# EAGLE design skyperobot (EAGLE 6.5.0)

## Sheet 1 of 3
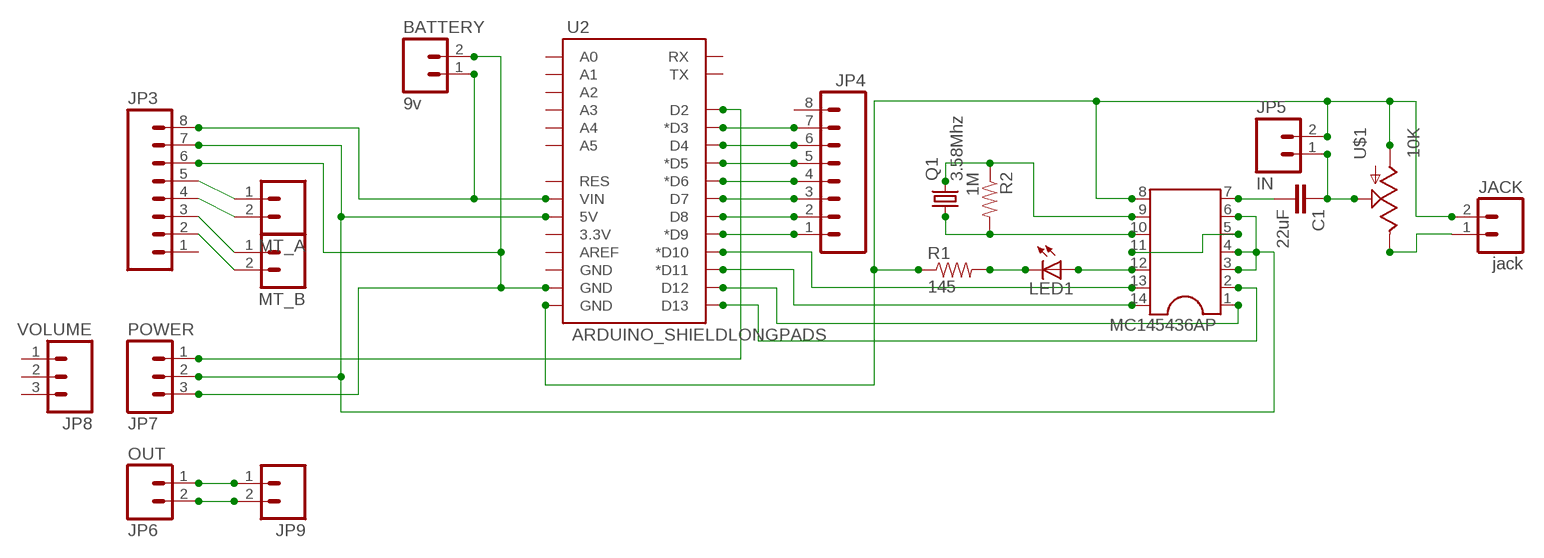
[diagram p0: schematic, sheet 1]

### Parts
BATTERY  9v  M02POLAR  [MOLEX-1X2]
C1  22uF  CAPPTH  [CAP-PTH-SMALL]
JACK  jack  M02LOCK_LONGPADS  [1X02_LOCK_LONGPADS]
JP3  M08LONGPADS  [1X08_LONGPADS]
JP4  M08LONGPADS  [1X08_LONGPADS]
JP5  IN  M02PTH  [1X02]
JP6  OUT  M02PTH  [1X02]
JP7  POWER  M03PTH  [1X03]
JP8  VOLUME  M03PTH  [1X03]
JP9  M02POLAR  [MOLEX-1X2]
LED1  LED3MM  [LED3MM]
MC145436AP  DIL14  [DIL14]
MT_A  M02POLAR  [MOLEX-1X2]
MT_B  M02POLAR  [MOLEX-1X2]
Q1  3.58Mhz  CRYSTALHC18U-H  [HC18U-H]
R1  145  RESISTORAXIAL-0.3  [AXIAL-0.3]
R2  1M  RESISTORAXIAL-0.3  [AXIAL-0.3]
U2  ARDUINO_SHIELDLONGPADS  [DUEMILANOVE_SHIELD_LONGPADS_NOHOLES]
U$1  10K  POTTRIM  [TRIM_POT_10MM]

### Nets
MT_A: JACK.2 JP5.2 MC145436AP.8 R1.P$1 U2.GND@0(GND) U$1.3(A)
N$1: MC145436AP.10 Q1.1 R2.P$2
N$2: MC145436AP.5 MC145436AP.11
N$3: JP3.7 JP7.2 MC145436AP.3 MC145436AP.4 MC145436AP.6 U2.5V
N$4 [power]: JP3.5 MT_A.1
N$5 [power]: JP3.4 MT_A.2
N$6 [power]: JP3.3 MT_B.1
N$7 [power]: JP3.2 MT_B.2
N$8: C1.2 MC145436AP.7
N$9: C1.1 JP5.1 U$1.1(S)
N$10: JP7.1 U2.D2
N$11 [power]: BATTERY.1 JP3.8 U2.VIN
N$12 [power]: BATTERY.2 JP3.6 JP7.3 U2.GND@1(GND)
N$15: LED1.K(C) R1.P$2
N$18: JP4.7 U2.D3(*D3)
N$19: JP4.6 U2.D4
N$20: JP4.5 U2.D5(*D5)
N$21: JP4.4 U2.D6(*D6)
N$22: JP4.3 U2.D7
N$23: JP4.2 U2.D8
N$24: JP4.1 U2.D9(*D9)
N$25: LED1.A MC145436AP.12
N$27: MC145436AP.1 U2.D12
N$30: JP6.1 JP9.1
N$31: JP6.2 JP9.2
N$34: MC145436AP.9 Q1.2 R2.P$1
N$39: MC145436AP.2 U2.D13
N$41: MC145436AP.14 U2.D11(*D11)
N$42: MC145436AP.13 U2.D10(*D10)
N$45: JACK.1 U$1.2(E)
Unconnected: JP3.1 JP4.8 JP8.1 JP8.2 JP8.3 U2.3.3V U2.A0 U2.A1 U2.A2 U2.A3 U2.A4 U2.A5 U2.AREF U2.GND@2(GND) U2.RES U2.RX U2.TX

## Sheet 2 of 3
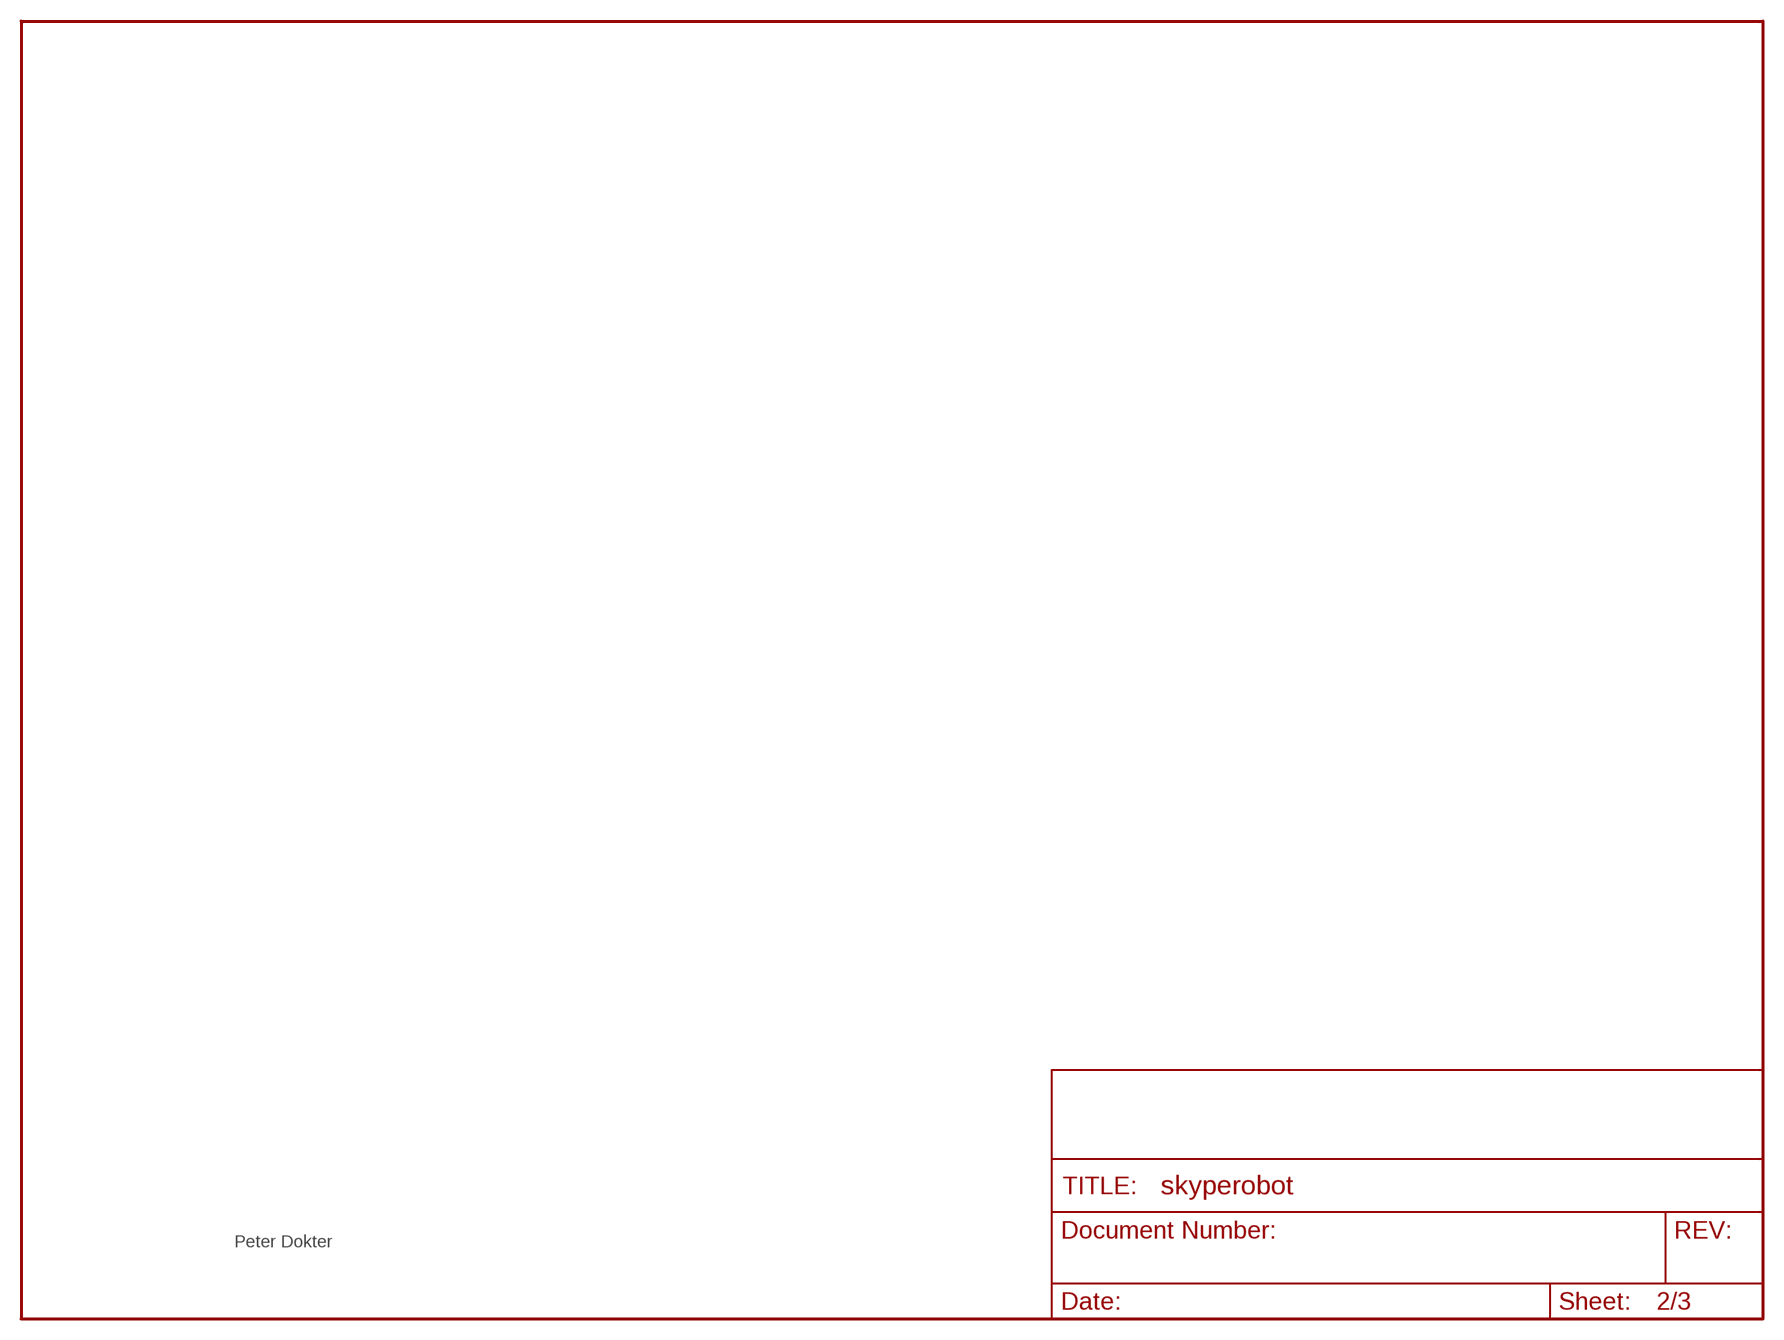
[diagram p1: schematic, sheet 2]

### Notes on the sheet
- Peter Dokter

## Sheet 3 of 3
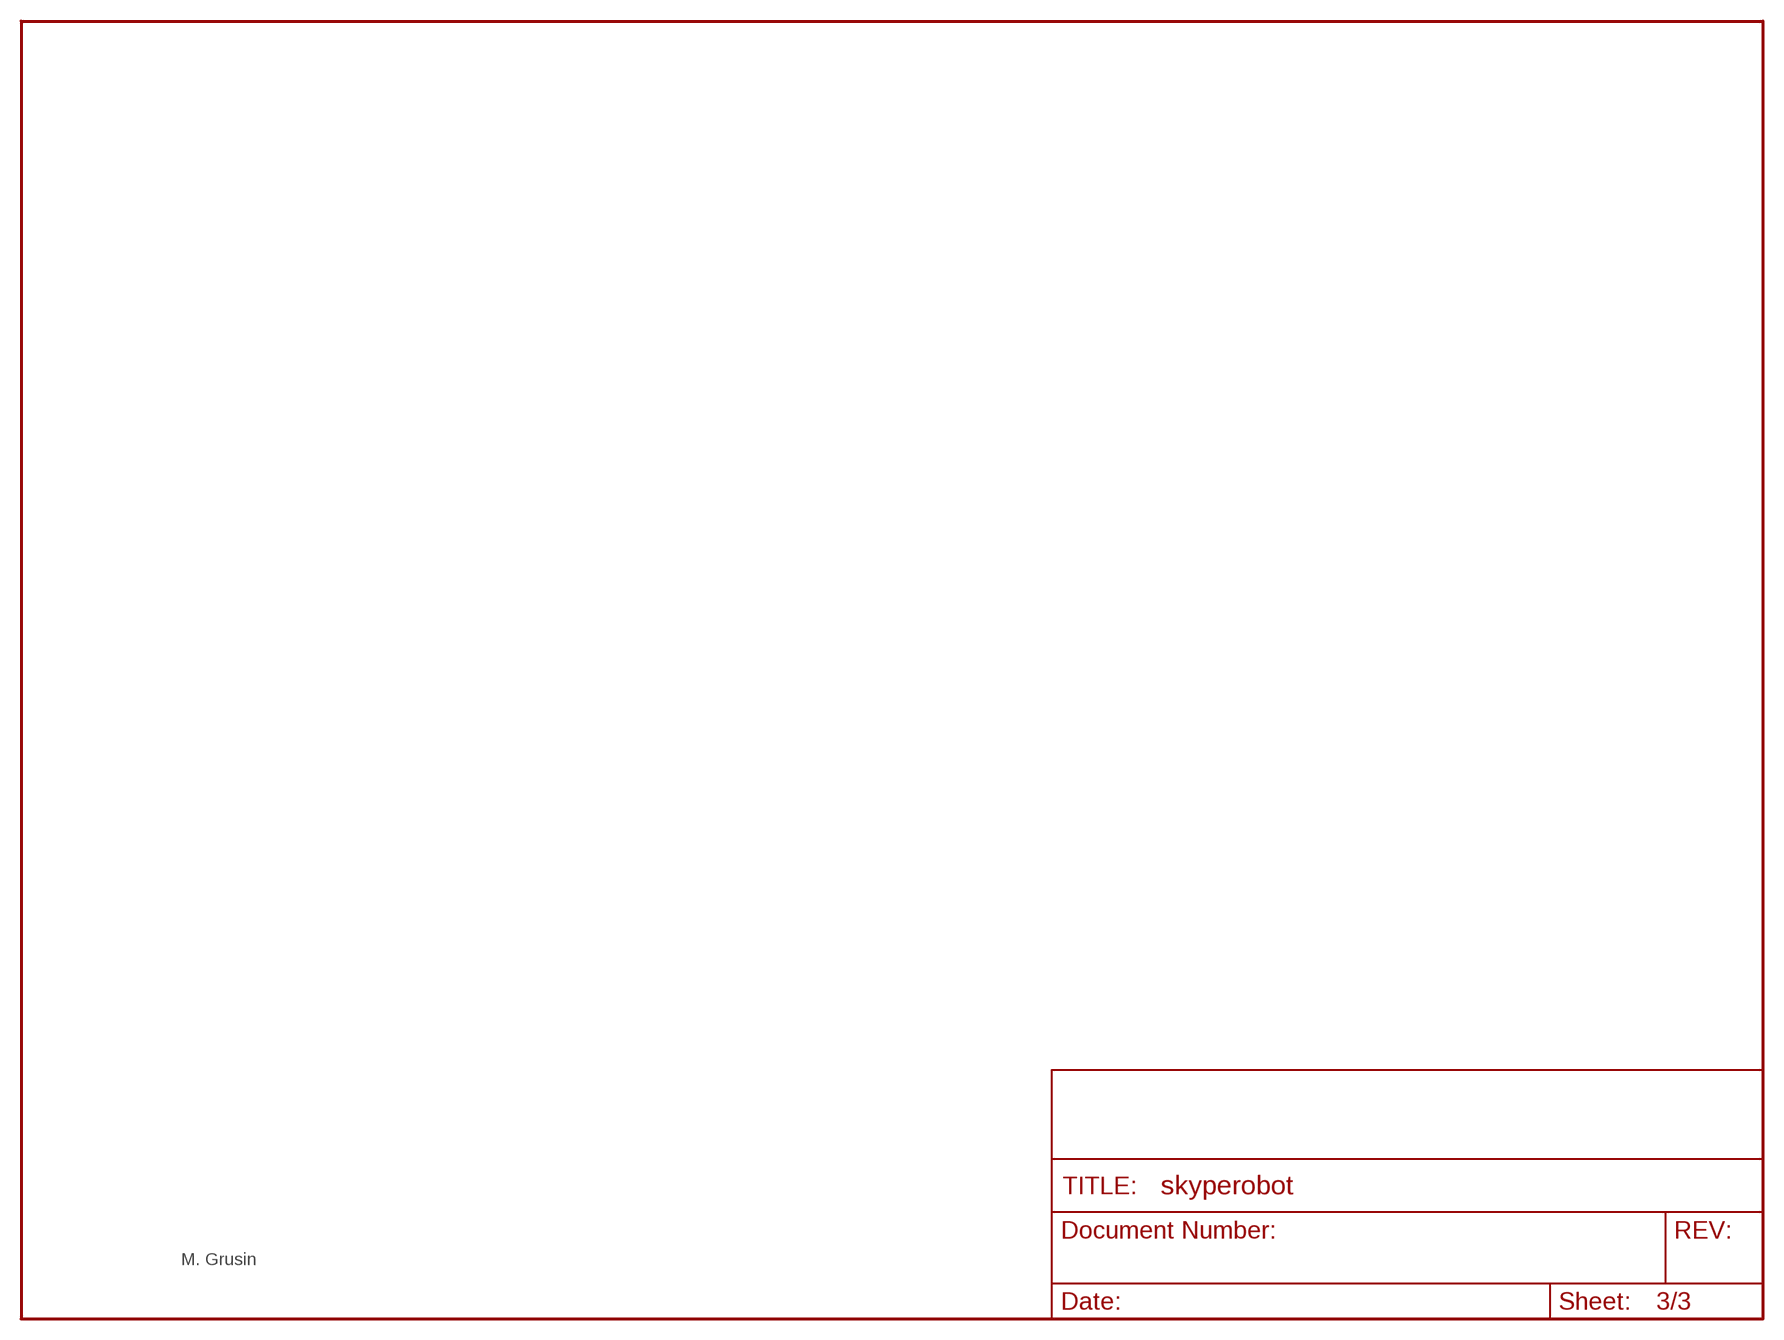
[diagram p2: schematic, sheet 3]

### Notes on the sheet
- M. Grusin

## Library data of the parts
BATTERY JACK JP5 JP6 JP9 MT_A MT_B = SparkFun:M02: Header 2 Standard 2-pin 0.1" header. Use with straight break away headers (SKU : PRT-00116), right angle break away headers (PRT-00553), swiss pins (PRT-00743), machine pins (PRT-00117), and female headers (PRT-00115). Molex polarized connector foot print use with SKU : PRT-08233 with associated crimp pins and housings.
C1 = SparkFun:CAP: Capacitor Standard 0603 ceramic capacitor, and 0.1" leaded capacitor.
JP3 JP4 = SparkFun:M08: Header 8 Standard 8-pin 0.1" header. Use with straight break away headers (SKU : PRT-00116), right angle break away headers (PRT-00553), swiss pins (PRT-00743), machine pins (PRT-00117), and female headers (PRT-00115).
JP7 JP8 = SparkFun:M03: Header 3 Standard 3-pin 0.1" header. Use with straight break away headers (SKU : PRT-00116), right angle break away headers (PRT-00553), swiss pins (PRT-00743), machine pins (PRT-00117), and female headers (PRT-00115). Molex polarized connector foot print use with SKU : PRT-08232 with associated crimp pins and housings.
LED1 = SparkFun:LED: LEDs Standard schematic elements and footprints for 5mm, 3mm, 1206, and 0603 sized LEDs. 5mm - Spark Fun Electronics SKU : COM-00529 (and others)
MC145436AP = ic-package:DIL14: Dual In Line / Socket
Q1 = crystal:CRYSTAL: CRYSTAL; OC_FARNELL: unknown; OC_NEWARK: unknown
R1 R2 = SparkFun:RESISTOR: Resistor Basic schematic elements and footprints for 0603, 1206, and PTH resistors.
U2 = SparkFun:ARDUINO_SHIELD
U$1 = SparkFun:POT

## Net classes
0 default: width 0.762 mm, clearance 0.254 mm
1 power: width 1.524 mm, clearance 0.508 mm to class 0, clearance 0.508 mm

## Board
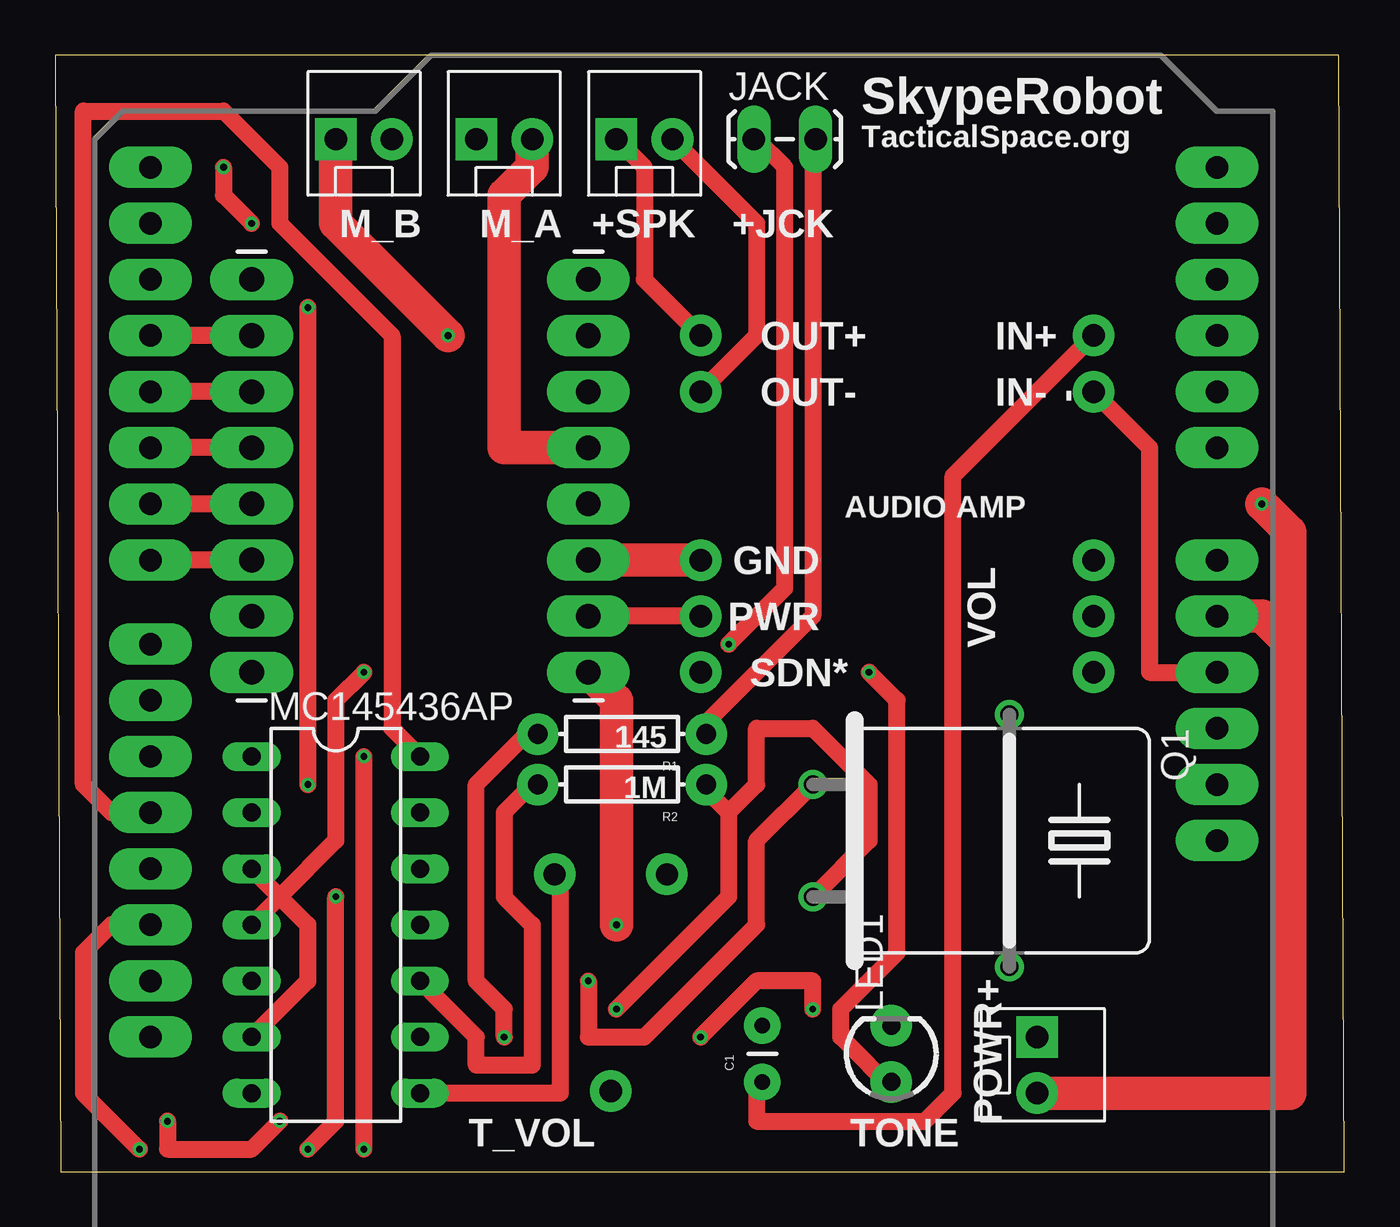
[diagram p3: board, top side]
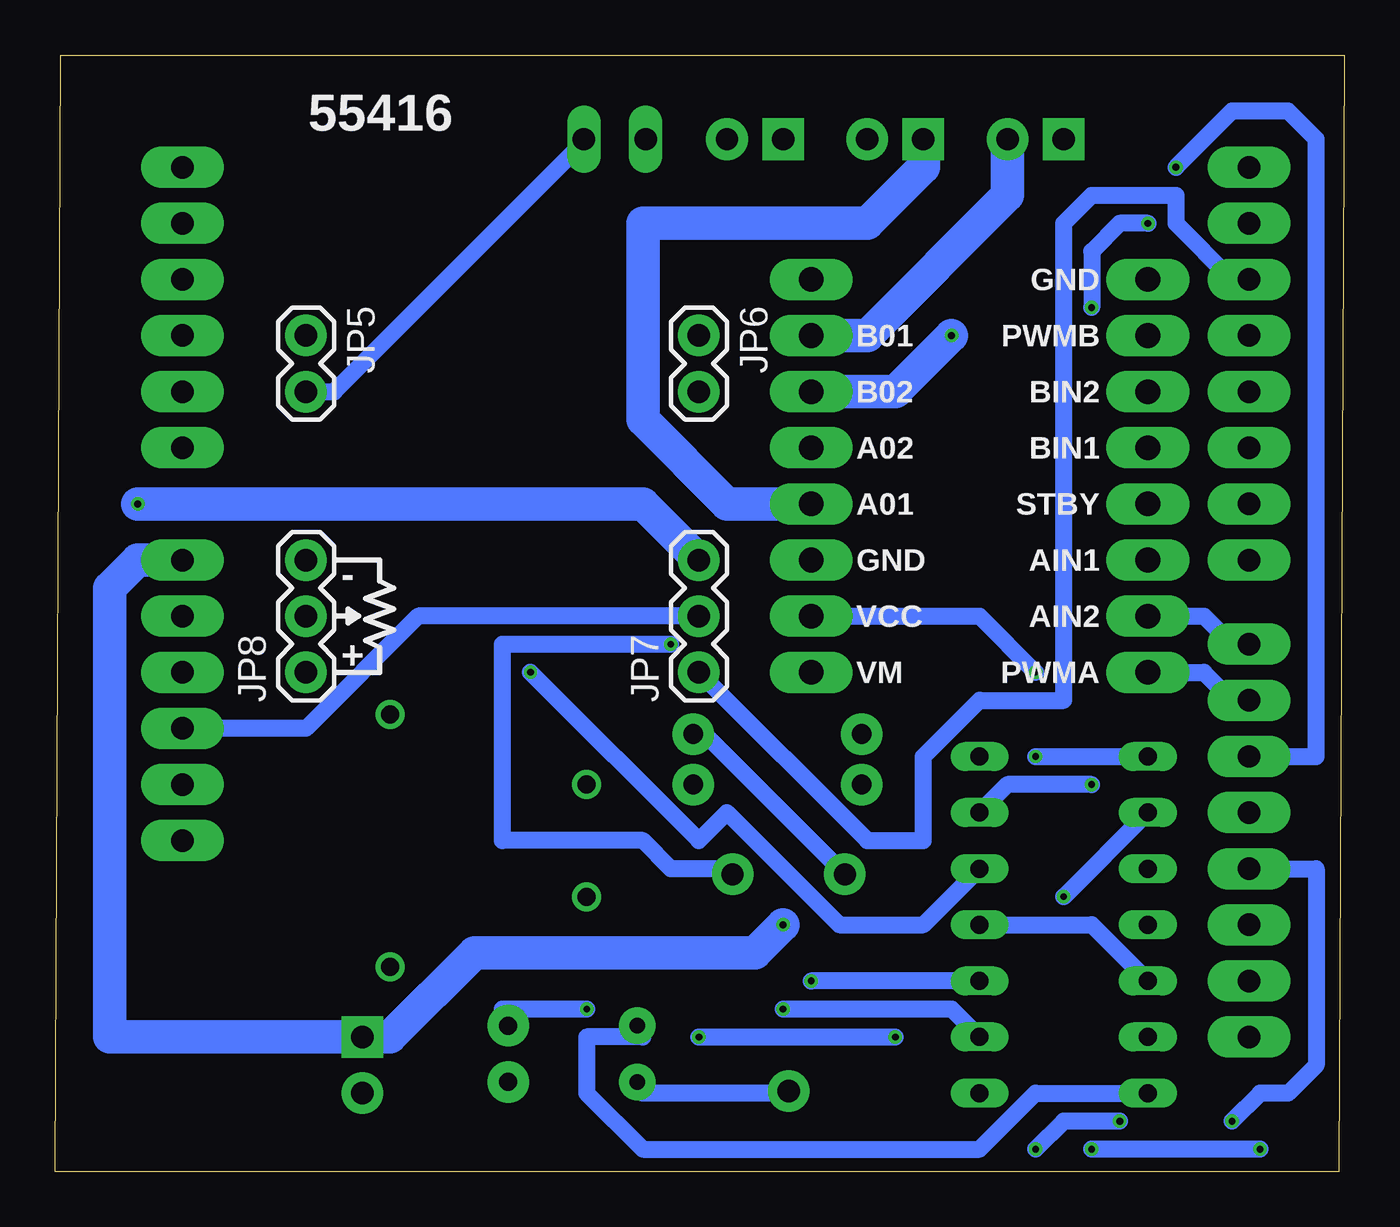
[diagram p4: board, bottom side, seen from below]

Size 58.34 x 50.54 mm. Coordinates in mm from the lower left corner, seen from the top.
Outline: 0.25,0 58.34,0 58.09,50.54 0,50.54 0.25,0
Copper layers (1*16): Top 0.035mm / dielectric 1.5mm / Bottom 0.035mm
Design rules "default": minimum track width 6mil, minimum drill 12mil, track to track 6mil, track to pad 6mil, pad to pad 6mil, via to via 6mil, smd to smd 0mil, copper to edge 10mil, drill to drill 10mil, minimum pad ring 10mil, minimum via ring 6mil, stop-mask expansion 2mil, vias tented up to drill 100mil, thermal gap 10mil

### Footprints (pad centres in the part's own frame; a part is rotated, then mirrored left to right if it is on the bottom)
MOLEX-1X2 = drill 1.016 pad 1.88 square: 1 0,0 | drill 1.016 pad 1.88: 2 2.54,0
CAP-PTH-SMALL = drill 0.7 pad 1.651: 1 0,0; 2 2.54,0
1X02_LOCK_LONGPADS = drill 1.016 long: 1 -0.127,0; 2 2.667,0
1X08_LONGPADS = drill 1.118 pad 1.88 long: 1 0,0; 2 2.54,0; 3 5.08,0; 4 7.62,0; 5 10.16,0; 6 12.7,0; 7 15.24,0; 8 17.78,0
1X02 = drill 1.016 pad 1.88: 1 0,0; 2 2.54,0
1X03 = drill 1.016 pad 1.88: 1 0,0; 2 2.54,0; 3 5.08,0
LED3MM = drill 0.813 pad 1.88: A -1.27,0; K 1.27,0
DIL14 = drill 0.813 long: 1 -7.62,-3.81; 2 -5.08,-3.81; 3 -2.54,-3.81; 4 0,-3.81; 5 2.54,-3.81; 6 5.08,-3.81; 7 7.62,-3.81; 8 7.62,3.81; 9 5.08,3.81; 10 2.54,3.81; 11 0,3.81; 12 -2.54,3.81; 13 -5.08,3.81; 14 -7.62,3.81
HC18U-H = drill 0.813: 1 -2.54,-5.08; 2 2.54,-5.08; M -5.715,3.81; M1 5.715,3.81
AXIAL-0.3 = drill 0.9 pad 1.88: P$1 -3.81,0; P$2 3.81,0
DUEMILANOVE_SHIELD_LONGPADS_NOHOLES = drill 1.016 pad 1.88 long: 3.3V 50.8,26.67; 5V 50.8,29.21; A0 50.8,41.91; A1 50.8,44.45; A2 50.8,46.99; A3 50.8,49.53; A4 50.8,52.07; A5 50.8,54.61; AREF 2.54,15.24; D2 2.54,49.53; D3 2.54,46.99; D4 2.54,44.45; D5 2.54,41.91; D6 2.54,39.37; D7 2.54,36.83; D8 2.54,33.02; D9 2.54,30.48; D10 2.54,27.94; D11 2.54,25.4; D12 2.54,22.86; D13 2.54,20.32; GND@0 50.8,31.75; GND@1 50.8,34.29; GND@2 2.54,17.78; RES 50.8,24.13; RX 2.54,54.61; TX 2.54,52.07; VIN 50.8,36.83
TRIM_POT_10MM = drill 1 pad 1.88: 1 9.81,0; 2 0,2.54; 3 0,-2.54

### Placement (x,y rotation side)
BATTERY  44.45,6.1 270 top
C1  32,4.06 90 top
JACK  31.75,46.74 0 top
JP3  24.13,40.39 270 top
JP4  8.89,22.61 90 top
JP5  46.99,37.85 270 bottom
JP6  29.21,37.85 270 bottom
JP7  29.21,22.61 90 bottom
JP8  46.99,22.61 90 bottom
JP9  25.4,46.74 0 top
LED1  37.85,5.33 90 top
MC145436AP  12.7,11.18 270 top
MT_A  19.05,46.74 0 top
MT_B  12.7,46.74 0 top
Q1  39.37,14.99 270 top
R1  25.65,19.81 180 top
R2  25.65,17.53 180 top
U2  1.78,-9.14 0 top
U$1  25.15,13.46 270 top

### Tracks (layer width: path | path; a pad name or v marks a point on that pad's centre or on a via)
MT_A
  Top 0.762: MC145436AP.8 22.86,3.56 22.86,13.72 U$1.3 | U2.GND@0 49.53,22.61 49.53,32.77 JP5.2 | R1.P$1 29.21,20.07 34.29,25.15 34.29,46.74 JACK.2
  Bottom 0.762: U$1.3 29.21,20.07 R1.P$1 | JP5.2 45.72,35.31 34.29,46.74 JACK.2
N$1  (via drill 0.3)
  Top 0.762: MC145436AP.10 19.05,6.1 19.05,4.83 21.59,4.83 21.59,11.18 20.32,12.45 20.32,16.26 21.59,17.53 R2.P$2 | Q1.1 31.75,14.99 31.75,11.18 26.67,6.1 24.13,6.1 v24.13,8.64
  Bottom 0.762: MC145436AP.10 v24.13,8.64
N$2
  Bottom 0.762: MC145436AP.5 11.43,11.18 MC145436AP.11
N$3  (via drill 0.3)
  Top 0.762: MC145436AP.6 11.43,8.64 11.43,11.18 10.16,12.45 | MC145436AP.3 10.16,12.45 | 10.16,12.45 MC145436AP.4 | JP7.2 JP3.7 | 10.16,12.45 12.7,14.99 12.7,21.34 v13.97,22.61
  Bottom 0.762: U2.5V 46.99,20.07 41.91,25.15 JP7.2 | v13.97,22.61 16.51,25.15 JP3.7
N$4
  Bottom 1.524: JP3.5 27.94,30.23 31.75,34.04 31.75,42.93 21.59,42.93 19.05,45.47 MT_A.1
N$5
  Top 1.524: JP3.4 20.32,32.77 20.32,44.2 21.59,45.47 MT_A.2
N$6  (via drill 0.3)
  Top 1.524: MT_B.1 12.7,42.93 v17.78,37.85
  Bottom 1.524: v17.78,37.85 20.32,35.31 JP3.3
N$7
  Bottom 1.524: JP3.2 21.59,37.85 15.24,44.2 MT_B.2
N$8
  Bottom 0.762: MC145436AP.7 13.97,3.56 16.51,1.02 31.75,1.02 34.29,3.56 34.29,6.1 31.75,6.1 C1.2
N$9
  Top 0.762: JP5.1 40.64,31.5 40.64,3.56 39.37,2.29 31.75,2.29 31.75,3.56 C1.1
  Bottom 0.762: C1.1 31.75,3.56 25.4,3.56 U$1.1
N$10
  Bottom 0.762: JP7.1 21.59,14.99 19.05,14.99 19.05,18.8 16.51,21.34 12.7,21.34 12.7,42.93 11.43,44.2 7.62,44.2 7.62,42.93 5.08,40.39 U2.D2
N$11  (via drill 0.3)
  Top 1.524: JP3.8 25.4,21.34 v25.4,11.18
  Bottom 1.524: v25.4,11.18 26.67,9.91 39.37,9.91 43.18,6.1 BATTERY.1 55.88,6.1 55.88,26.42 54.61,27.69 U2.VIN
N$12  (via drill 0.3)
  Top 1.524: JP7.3 JP3.6 | BATTERY.2 55.88,3.56 55.88,23.88 | 55.88,23.88 54.61,25.15 U2.GND@1 | v54.61,30.23 55.88,28.96 55.88,23.88
  Bottom 1.524: JP7.3 31.75,30.23 v54.61,30.23
N$15  (via drill 0.3)
  Top 0.762: v20.32,6.1 20.32,7.37 19.05,8.64 19.05,17.53 21.59,20.07 R1.P$2 | v29.21,6.1 31.75,8.64 34.29,8.64 v34.29,7.37
  Bottom 0.762: v29.21,6.1 v20.32,6.1 | v34.29,7.37 38.1,7.37 LED1.K
N$18
  Top 0.762: JP4.7 U2.D3
N$19
  Top 0.762: JP4.6 U2.D4
N$20
  Top 0.762: JP4.5 U2.D5
N$21
  Top 0.762: JP4.4 U2.D6
N$22
  Top 0.762: JP4.3 U2.D7
N$23
  Bottom 0.762: JP4.2 6.35,25.15 5.08,23.88 U2.D8
N$24
  Bottom 0.762: JP4.1 6.35,22.61 5.08,21.34 U2.D9
N$25  (via drill 0.3)
  Top 0.762: v36.83,22.61 38.1,21.34 38.1,9.91 35.56,7.37 35.56,6.1 38.1,3.56 LED1.A
  Bottom 0.762: MC145436AP.12 19.05,11.18 22.86,11.18 27.94,16.26 29.21,14.99 v36.83,22.61
N$27  (via drill 0.3)
  Top 0.762: v13.97,1.02 v13.97,18.8 | v10.16,2.29 8.89,1.02 5.08,1.02 v5.08,2.29
  Bottom 0.762: v13.97,18.8 MC145436AP.1 | v13.97,1.02 12.7,2.29 v10.16,2.29 | v5.08,2.29 3.81,3.56 2.54,3.56 1.27,4.83 1.27,13.72 U2.D12
N$30
  Top 0.762: JP6.1 26.67,40.39 26.67,45.47 JP9.1
N$31
  Top 0.762: JP6.2 31.75,37.85 31.75,42.93 JP9.2
N$34  (via drill 0.3)
  Top 0.762: v25.4,7.37 30.48,12.45 30.48,16.26 | 30.48,16.26 29.21,17.53 R2.P$1 | Q1.2 36.83,14.99 36.83,17.53 34.29,20.07 31.75,20.07 31.75,17.53 30.48,16.26
  Bottom 0.762: MC145436AP.9 17.78,7.37 v25.4,7.37
N$39  (via drill 0.3)
  Top 0.762: v12.7,12.45 12.7,2.29 v11.43,1.02 | v3.81,1.02 1.27,3.56 1.27,9.91 2.54,11.18 U2.D13
  Bottom 0.762: v12.7,12.45 MC145436AP.2 | v3.81,1.02 v11.43,1.02
N$41
  Top 0.762: MC145436AP.14 15.24,20.07 15.24,37.85 10.16,42.93 10.16,45.47 7.62,48.01 1.27,48.01 1.27,17.53 2.54,16.26 U2.D11
N$42  (via drill 0.3)
  Top 0.762: v11.43,39.12 v11.43,17.53 | v8.89,42.93 7.62,44.2 v7.62,45.47
  Bottom 0.762: MC145436AP.13 15.24,17.53 v11.43,17.53 | v11.43,39.12 11.43,41.66 10.16,42.93 v8.89,42.93 | v7.62,45.47 5.08,48.01 2.54,48.01 1.27,46.74 1.27,18.8 U2.D10
N$45  (via drill 0.3)
  Top 0.762: v30.48,23.88 33.02,26.42 33.02,45.47 31.75,46.74 JACK.1
  Bottom 0.762: v30.48,23.88 38.1,23.88 38.1,14.99 31.75,14.99 30.48,13.72 27.94,13.72 U$1.2

### Text on the board
tPlace: SkypeRobot | TacticalSpace.org | M_B | M_A | +SPK | +JCK | OUT+ | IN+ | OUT- | IN- | - | AUDIO AMP | GND | PWR | SDN* | VOL | POWR+ | T_VOL | TONE
bPlace: 55416 | GND | PWMB | B01 | BIN2 | B02 | BIN1 | A02 | STBY | A01 | AIN1 | GND | - | AIN2 | VCC | PWMA | VM | +
Measures: 0.00" | 0.05" | 0.75" | 0.80" | 0.80" | 0.55" | 0.05" | 0.00"